# Altium project LA_Probe.PrjPcb
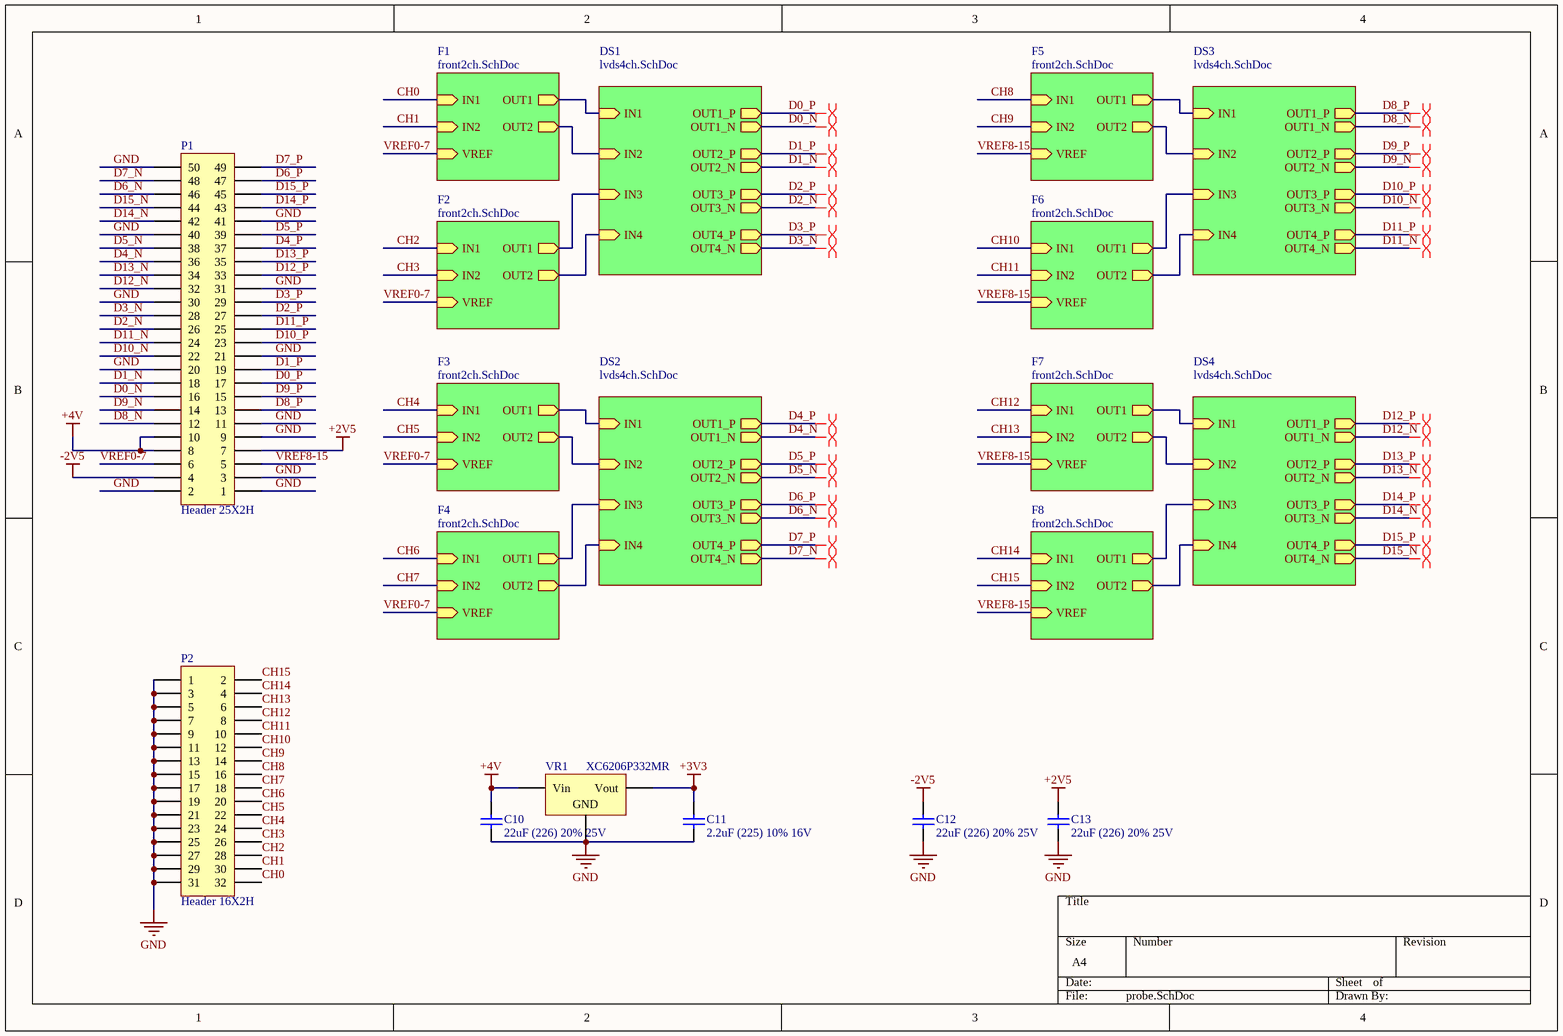
[diagram p0: probe.SchDoc]
3 sheets, 179 parts. Net scope: hierarchical (ports join the sheet entries above them; power ports are global).
Board file: probe.PcbDoc
Sheets:
  probe.SchDoc
    F1 = front2ch.SchDoc
    F2 = front2ch.SchDoc
    DS1 = lvds4ch.SchDoc
    F3 = front2ch.SchDoc
    F4 = front2ch.SchDoc
    DS2 = lvds4ch.SchDoc
    F5 = front2ch.SchDoc
    F6 = front2ch.SchDoc
    DS3 = lvds4ch.SchDoc
    F7 = front2ch.SchDoc
    F8 = front2ch.SchDoc
    DS4 = lvds4ch.SchDoc

## Sheet probe.SchDoc
size A4

### Parts
C10  22uF (226) 20% 25V  [0805_C]
C11  2.2uF (225) 10% 16V  [0603_C]
C12  22uF (226) 20% 25V  [0805_C]
C13  22uF (226) 20% 25V  [0805_C]
P1  Header 25X2H  [HDR2X25H]
P2  Header 16X2H  [HDR2X16H]
VR1  XC6206P332MR  [SOT-23-3L]

### Sub-sheets
DS1 = lvds4ch.SchDoc: OUT4_N (out), OUT3_P (out), OUT2_P (out), OUT1_P (out), OUT4_P (out), OUT2_N (out), OUT3_N (out), IN4 (in), IN3 (in), OUT1_N (out), IN1 (in), IN2 (in)
DS2 = lvds4ch.SchDoc: OUT4_N (out), OUT3_P (out), OUT2_P (out), OUT1_P (out), OUT4_P (out), OUT2_N (out), OUT3_N (out), IN4 (in), IN3 (in), OUT1_N (out), IN1 (in), IN2 (in)
DS3 = lvds4ch.SchDoc: OUT4_N (out), OUT3_P (out), OUT2_P (out), OUT1_P (out), OUT4_P (out), OUT2_N (out), OUT3_N (out), IN4 (in), IN3 (in), OUT1_N (out), IN1 (in), IN2 (in)
DS4 = lvds4ch.SchDoc: OUT4_N (out), OUT3_P (out), OUT2_P (out), OUT1_P (out), OUT4_P (out), OUT2_N (out), OUT3_N (out), IN4 (in), IN3 (in), OUT1_N (out), IN1 (in), IN2 (in)
F1 = front2ch.SchDoc: IN1 (in), OUT1 (out), IN2 (in), VREF (in), OUT2 (out)
F2 = front2ch.SchDoc: IN1 (in), OUT1 (out), IN2 (in), VREF (in), OUT2 (out)
F3 = front2ch.SchDoc: IN1 (in), OUT1 (out), IN2 (in), VREF (in), OUT2 (out)
F4 = front2ch.SchDoc: IN1 (in), OUT1 (out), IN2 (in), VREF (in), OUT2 (out)
F5 = front2ch.SchDoc: IN1 (in), OUT1 (out), IN2 (in), VREF (in), OUT2 (out)
F6 = front2ch.SchDoc: IN1 (in), OUT1 (out), IN2 (in), VREF (in), OUT2 (out)
F7 = front2ch.SchDoc: IN1 (in), OUT1 (out), IN2 (in), VREF (in), OUT2 (out)
F8 = front2ch.SchDoc: IN1 (in), OUT1 (out), IN2 (in), VREF (in), OUT2 (out)

### Nets
+2V5: C13.2 P1.7
+3V3: C11.2 VR1.2(Vout)
+4V: C10.2 P1.8 P1.10 VR1.3(Vin)
-2V5: C12.2 P1.4
GND: C10.1 C11.1 C12.1 C13.1 P1.1 P1.2 P1.3 P1.9 P1.11 P1.20 P1.21 P1.30 P1.31 P1.40 P1.41 P1.50 P2.1 P2.3 P2.5 P2.7 P2.9 P2.11 P2.13 P2.15 P2.17 P2.19 P2.21 P2.23 P2.25 P2.27 P2.29 P2.31 VR1.1(GND)
CH0: P2.32 ; sheet F1/IN1
CH1: P2.30 ; sheet F1/IN2
CH2: P2.28 ; sheet F2/IN1
CH3: P2.26 ; sheet F2/IN2
CH4: P2.24 ; sheet F3/IN1
CH5: P2.22 ; sheet F3/IN2
CH6: P2.20 ; sheet F4/IN1
CH7: P2.18 ; sheet F4/IN2
CH8: P2.16 ; sheet F5/IN1
CH9: P2.14 ; sheet F5/IN2
CH10: P2.12 ; sheet F6/IN1
CH11: P2.10 ; sheet F6/IN2
CH12: P2.8 ; sheet F7/IN1
CH13: P2.6 ; sheet F7/IN2
CH14: P2.4 ; sheet F8/IN1
CH15: P2.2 ; sheet F8/IN2
D0_N: P1.16 ; sheet DS1/OUT1_N
D0_P: P1.17 ; sheet DS1/OUT1_P
D1_N: P1.18 ; sheet DS1/OUT2_N
D1_P: P1.19 ; sheet DS1/OUT2_P
D2_N: P1.26 ; sheet DS1/OUT3_N
D2_P: P1.27 ; sheet DS1/OUT3_P
D3_N: P1.28 ; sheet DS1/OUT4_N
D3_P: P1.29 ; sheet DS1/OUT4_P
D4_N: P1.36 ; sheet DS2/OUT1_N
D4_P: P1.37 ; sheet DS2/OUT1_P
D5_N: P1.38 ; sheet DS2/OUT2_N
D5_P: P1.39 ; sheet DS2/OUT2_P
D6_N: P1.46 ; sheet DS2/OUT3_N
D6_P: P1.47 ; sheet DS2/OUT3_P
D7_N: P1.48 ; sheet DS2/OUT4_N
D7_P: P1.49 ; sheet DS2/OUT4_P
D8_N: P1.12 ; sheet DS3/OUT1_N
D8_P: P1.13 ; sheet DS3/OUT1_P
D9_N: P1.14 ; sheet DS3/OUT2_N
D9_P: P1.15 ; sheet DS3/OUT2_P
D10_N: P1.22 ; sheet DS3/OUT3_N
D10_P: P1.23 ; sheet DS3/OUT3_P
D11_N: P1.24 ; sheet DS3/OUT4_N
D11_P: P1.25 ; sheet DS3/OUT4_P
D12_N: P1.32 ; sheet DS4/OUT1_N
D12_P: P1.33 ; sheet DS4/OUT1_P
D13_N: P1.34 ; sheet DS4/OUT2_N
D13_P: P1.35 ; sheet DS4/OUT2_P
D14_N: P1.42 ; sheet DS4/OUT3_N
D14_P: P1.43 ; sheet DS4/OUT3_P
D15_N: P1.44 ; sheet DS4/OUT4_N
D15_P: P1.45 ; sheet DS4/OUT4_P
VREF0-7: P1.6 ; sheet F1/VREF, sheet F2/VREF, sheet F3/VREF, sheet F4/VREF
VREF8-15: P1.5 ; sheet F5/VREF, sheet F6/VREF, sheet F7/VREF, sheet F8/VREF
NetD1_F1_2: sheet F1/OUT1, sheet DS1/IN1
NetD1_F2_2: sheet F2/OUT1, sheet DS1/IN3
NetD1_F3_2: sheet F3/OUT1, sheet DS2/IN1
NetD1_F4_2: sheet F4/OUT1, sheet DS2/IN3
NetD1_F5_2: sheet F5/OUT1, sheet DS3/IN1
NetD1_F6_2: sheet F6/OUT1, sheet DS3/IN3
NetD1_F7_2: sheet F7/OUT1, sheet DS4/IN1
NetD1_F8_2: sheet F8/OUT1, sheet DS4/IN3
NetD2_F1_2: sheet F1/OUT2, sheet DS1/IN2
NetD2_F2_2: sheet F2/OUT2, sheet DS1/IN4
NetD2_F3_2: sheet F3/OUT2, sheet DS2/IN2
NetD2_F4_2: sheet F4/OUT2, sheet DS2/IN4
NetD2_F5_2: sheet F5/OUT2, sheet DS3/IN2
NetD2_F6_2: sheet F6/OUT2, sheet DS3/IN4
NetD2_F7_2: sheet F7/OUT2, sheet DS4/IN2
NetD2_F8_2: sheet F8/OUT2, sheet DS4/IN4

### Layout directives
differential pair: D0_N, D0_P, D1_N, D1_P, D2_N, D2_P, D3_N, D3_P, D4_N, D4_P, D5_N, D5_P, D6_N, D6_P, D7_N, D7_P, D8_N, D8_P, D9_N, D9_P, D10_N, D10_P, D11_N, D11_P, D12_N, D12_P, D13_N, D13_P, D14_N, D14_P, D15_N, D15_P

### Library data of the parts
C10 C12 C13 = 0805 22uF (226) 20% 25V: 贴片电容; ComponentLink1Description: 供应商链接; ComponentLink1URL: http://www.szlcsc.com/product/details_46786.html; Package: 0805; Supplier: LC; SuppliersPartNumber: C45783
C11 = 0603 2.2uF (225) 10% 16V: 贴片电容; ComponentLink1Description: 供应商链接; ComponentLink1URL: http://www.szlcsc.com/product/details_24366.html; Package: 0603; Supplier: LC; SuppliersPartNumber: C23630
P1 = Header 25X2H: Header, 25-Pin, Dual row, Right Angle; LatestRevisionDate: 17-Jul-2002; LatestRevisionNote: Re-released for DXP Platform.; Publisher: Altium Limited
P2 = Header 16X2H: Header, 16-Pin, Dual row, Right Angle; LatestRevisionDate: 17-Jul-2002; LatestRevisionNote: Re-released for DXP Platform.; Publisher: Altium Limited
VR1 = SOT-23 XC6206P332MR: 低压差线性稳压(LDO); ComponentLink1Description: 供应商链接; ComponentLink1URL: http://www.szlcsc.com/product/details_5896.html; Package: SOT-23; Supplier: LC; SuppliersPartNumber: C5446

## Sheet front2ch.SchDoc
size A4
Used 8 times, as channels F1, F2, F3, F4, F5, F6, F7, F8. Parts and nets are listed once, with the designators drawn on the sheet.
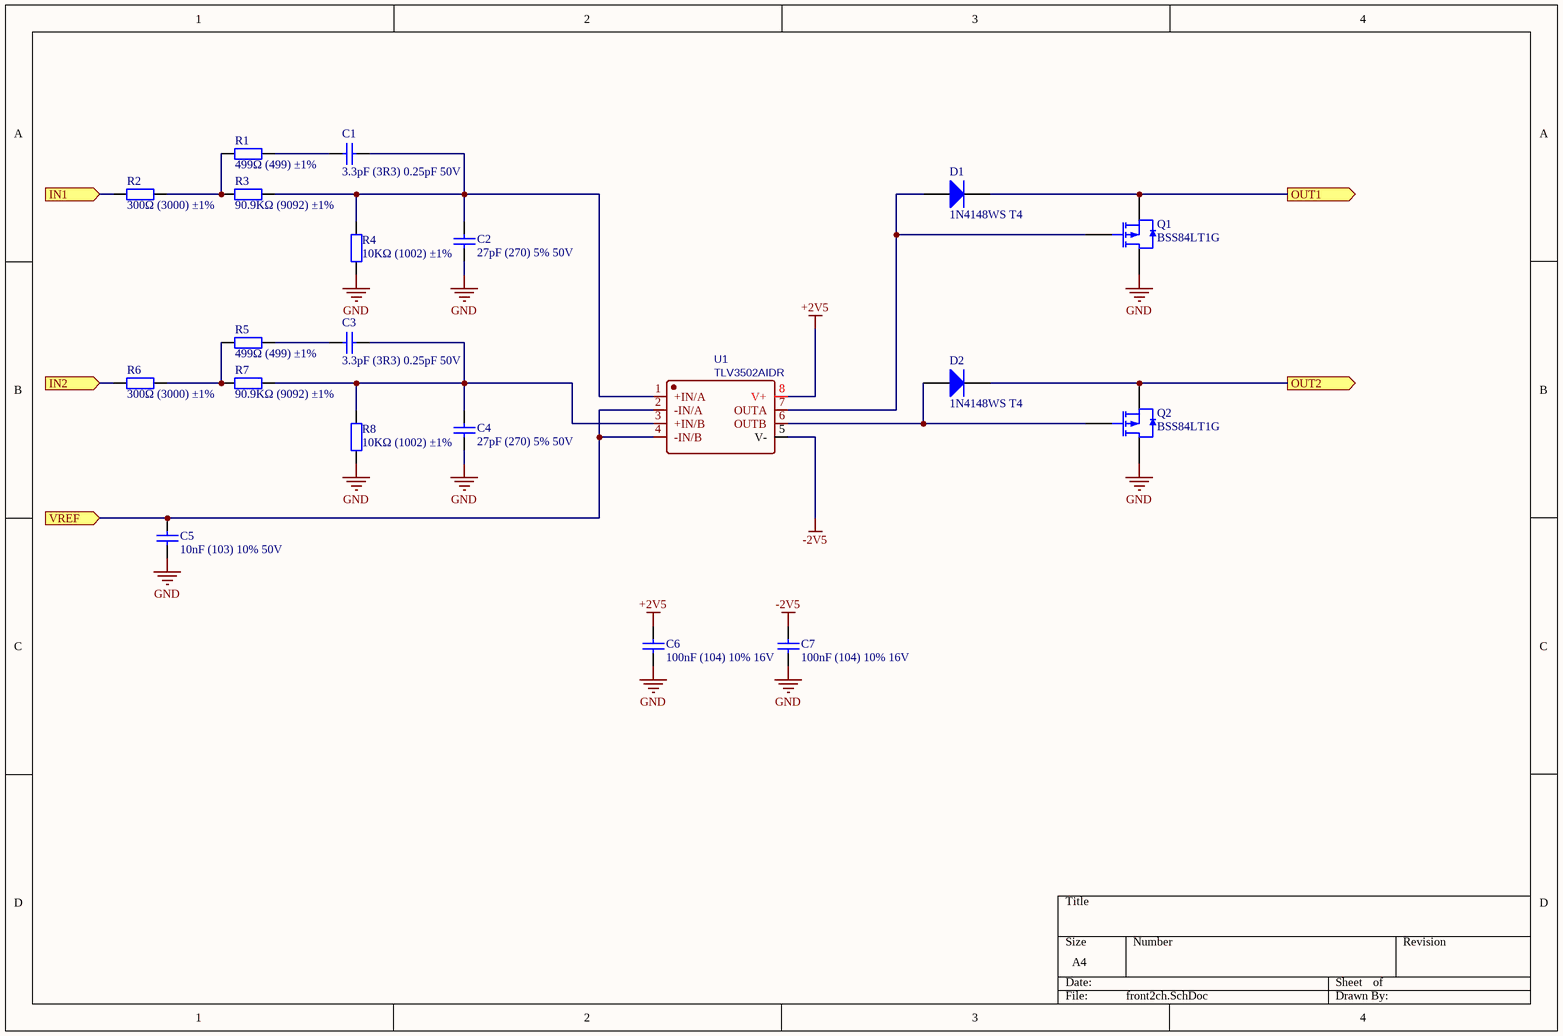
[diagram p1: front2ch.SchDoc]

### Parts
C1  3.3pF (3R3) 0.25pF 50V  [0402_C]
C2  27pF (270) 5% 50V  [0402_C]
C3  3.3pF (3R3) 0.25pF 50V  [0402_C]
C4  27pF (270) 5% 50V  [0402_C]
C5  10nF (103) 10% 50V  [0402_C]
C6  100nF (104) 10% 16V  [0402_C]
C7  100nF (104) 10% 16V  [0402_C]
D1  1N4148WS T4  [SOD-323]
D2  1N4148WS T4  [SOD-323]
Q1  BSS84LT1G  [SOT-23(SOT-23-3)]
Q2  BSS84LT1G  [SOT-23(SOT-23-3)]
R1  499Ω (499) ±1%  [0402_R]
R2  300Ω (3000) ±1%  [0402_R]
R3  90.9KΩ (9092) ±1%  [0402_R]
R4  10KΩ (1002) ±1%  [0402_R]
R5  499Ω (499) ±1%  [0402_R]
R6  300Ω (3000) ±1%  [0402_R]
R7  90.9KΩ (9092) ±1%  [0402_R]
R8  10KΩ (1002) ±1%  [0402_R]
U1  TLV3502AIDR  [SOIC-8_150mil]

### Ports
IN1 (in), IN2 (in), OUT1 (out), OUT2 (out), VREF (in)

### Nets
+2V5: C6.2 U1.8(V+)
-2V5: C7.2 U1.5(V-)
GND: C2.1 C4.1 C5.1 C6.1 C7.1 Q1.3(D) Q2.3(D) R4.1 R8.1
IN1: R2.1 ; port IN1
IN2: R6.1 ; port IN2
OUT1: D1.2(K) Q1.2(S) ; port OUT1
OUT2: D2.2(K) Q2.2(S) ; port OUT2
VREF: C5.2 U1.2(-IN/A) U1.4(-IN/B) ; port VREF
NetC1_1: C1.1 R1.2
NetC1_2: C1.2 C2.2 R3.2 R4.2 U1.1(+IN/A)
NetC3_1: C3.1 R5.2
NetC3_2: C3.2 C4.2 R7.2 R8.2 U1.3(+IN/B)
NetD1_1: D1.1(A) Q1.1(G) U1.7(OUTA)
NetD2_1: D2.1(A) Q2.1(G) U1.6(OUTB)
NetR1_1: R1.1 R2.2 R3.1
NetR5_1: R5.1 R6.2 R7.1

### Channels
F1: designators end in _F1; ports IN1=CH0 IN2=CH1 OUT1=NetD1_F1_2 OUT2=NetD2_F1_2 VREF=VREF0-7
F2: designators end in _F2; ports IN1=CH2 IN2=CH3 OUT1=NetD1_F2_2 OUT2=NetD2_F2_2 VREF=VREF0-7
F3: designators end in _F3; ports IN1=CH4 IN2=CH5 OUT1=NetD1_F3_2 OUT2=NetD2_F3_2 VREF=VREF0-7
F4: designators end in _F4; ports IN1=CH6 IN2=CH7 OUT1=NetD1_F4_2 OUT2=NetD2_F4_2 VREF=VREF0-7
F5: designators end in _F5; ports IN1=CH8 IN2=CH9 OUT1=NetD1_F5_2 OUT2=NetD2_F5_2 VREF=VREF8-15
F6: designators end in _F6; ports IN1=CH10 IN2=CH11 OUT1=NetD1_F6_2 OUT2=NetD2_F6_2 VREF=VREF8-15
F7: designators end in _F7; ports IN1=CH12 IN2=CH13 OUT1=NetD1_F7_2 OUT2=NetD2_F7_2 VREF=VREF8-15
F8: designators end in _F8; ports IN1=CH14 IN2=CH15 OUT1=NetD1_F8_2 OUT2=NetD2_F8_2 VREF=VREF8-15

### Library data of the parts
C1 C3 = 0402 3.3pF (3R3) 0.25pF 50V: 贴片电容; ComponentLink1Description: 供应商链接; ComponentLink1URL: http://www.szlcsc.com/product/details_1917.html; Package: 0402; Supplier: LC; SuppliersPartNumber: C1565
C2 C4 = 0402 27pF (270) 5% 50V: 贴片电容; ComponentLink1Description: 供应商链接; ComponentLink1URL: http://www.szlcsc.com/product/details_1909.html; Package: 0402; Supplier: LC; SuppliersPartNumber: C1557
C5 = 0402 10nF (103) 10% 50V: 贴片电容; ComponentLink1Description: 供应商链接; ComponentLink1URL: http://www.szlcsc.com/product/details_15869.html; Package: 0402; Supplier: LC; SuppliersPartNumber: C15195
C6 C7 = 0402 100nF (104) 10% 16V: 贴片电容; ComponentLink1Description: 供应商链接; ComponentLink1URL: http://www.szlcsc.com/product/details_1877.html; Package: 0402; Supplier: LC; SuppliersPartNumber: C1525
D1 D2 = SOD-323 1N4148WS T4: 二极管; ComponentLink1Description: 供应商链接; ComponentLink1URL: http://www.szlcsc.com/product/details_2485.html; Package: SOD-323; Supplier: LC; SuppliersPartNumber: C2128
Q1 Q2 = BSS84LT1G: MOS(场效应管); ComponentLink1Description: 供应商链接; ComponentLink1URL: http://www.szlcsc.com/product/details_8986.html; Package: SOT-23(SOT-23-3); Supplier: LC; SuppliersPartNumber: C8492
R1 R5 = 0402 49.9Ω (49R9) 1%: 贴片电阻; ComponentLink1Description: 供应商链接; ComponentLink1URL: http://www.szlcsc.com/product/details_25863.html; Package: 0402; Supplier: LC; SuppliersPartNumber: C57982
R2 R6 = 0402 300Ω (3000) 1%: 贴片电阻; ComponentLink1Description: 供应商链接; ComponentLink1URL: http://www.szlcsc.com/product/details_25845.html; Package: 0402; Supplier: LC; SuppliersPartNumber: C25102
R3 R7 = 0402 8.2KΩ (8201) 1%: 贴片电阻; ComponentLink1Description: 供应商链接; ComponentLink1URL: http://www.szlcsc.com/product/details_26667.html; Package: 0402; Supplier: LC; SuppliersPartNumber: C26989
R4 R8 = 0402 10KΩ (1002) 1%: 贴片电阻; ComponentLink1Description: 供应商链接; ComponentLink1URL: http://www.szlcsc.com/product/details_26487.html; Package: 0402; Supplier: LC; SuppliersPartNumber: C25744
U1 = TLV3502AIDR: BOM_Manufacturer: TI; Contributor: LCSC; SMT Type: Extend; BOM_Supplier: LCSC; BOM_Manufacturer Part: TLV3502AIDR; BOM_Supplier Part: C131165; BOM_LCSC Assembly: Yes; spicePre: U; spiceSymbolName: TLV3502AIDR

## Sheet lvds4ch.SchDoc
size A4
Used 4 times, as channels DS1, DS2, DS3, DS4. Parts and nets are listed once, with the designators drawn on the sheet.
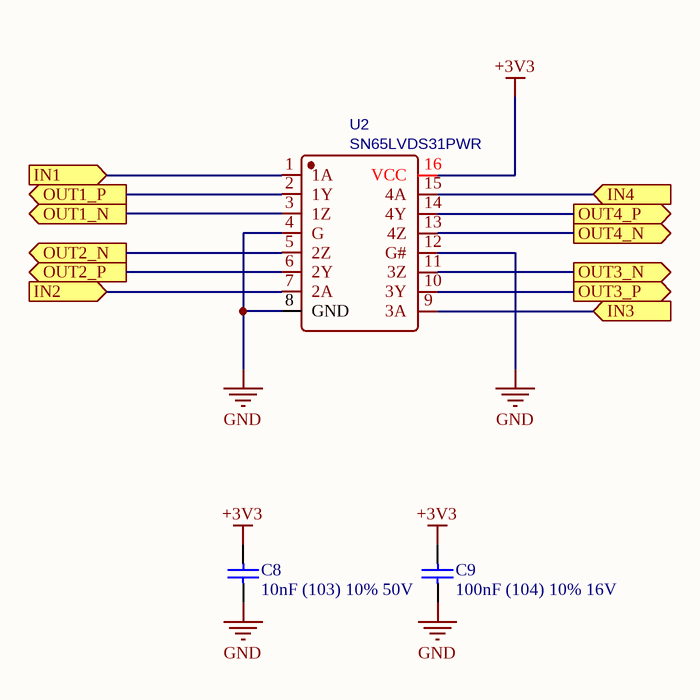
[diagram p2: lvds4ch.SchDoc]

### Parts
C8  10nF (103) 10% 50V  [0402_C]
C9  100nF (104) 10% 16V  [0402_C]
U2  SN65LVDS31PWR  [TSSOP-16_L5.0-W4.4-P0.65-LS6.4-BL]

### Ports
IN1 (in), IN2 (in), IN3 (in), IN4 (in), OUT1_N (out), OUT1_P (out), OUT2_N (out), OUT2_P (out), OUT3_N (out), OUT3_P (out), OUT4_N (out), OUT4_P (out)

### Nets
+3V3: C8.2 C9.2 U2.16(VCC)
GND: C8.1 C9.1 U2.4(G) U2.8(GND) U2.12(G#)
IN1: U2.1(1A) ; port IN1
IN2: U2.7(2A) ; port IN2
IN3: U2.9(3A) ; port IN3
IN4: U2.15(4A) ; port IN4
OUT1_N: U2.3(1Z) ; port OUT1_N
OUT1_P: U2.2(1Y) ; port OUT1_P
OUT2_N: U2.5(2Z) ; port OUT2_N
OUT2_P: U2.6(2Y) ; port OUT2_P
OUT3_N: U2.11(3Z) ; port OUT3_N
OUT3_P: U2.10(3Y) ; port OUT3_P
OUT4_N: U2.13(4Z) ; port OUT4_N
OUT4_P: U2.14(4Y) ; port OUT4_P

### Channels
DS1: designators end in _DS1; ports IN1=NetD1_F1_2 IN2=NetD2_F1_2 IN3=NetD1_F2_2 IN4=NetD2_F2_2 OUT1_N=D0_N OUT1_P=D0_P OUT2_N=D1_N OUT2_P=D1_P OUT3_N=D2_N OUT3_P=D2_P OUT4_N=D3_N OUT4_P=D3_P
DS2: designators end in _DS2; ports IN1=NetD1_F3_2 IN2=NetD2_F3_2 IN3=NetD1_F4_2 IN4=NetD2_F4_2 OUT1_N=D4_N OUT1_P=D4_P OUT2_N=D5_N OUT2_P=D5_P OUT3_N=D6_N OUT3_P=D6_P OUT4_N=D7_N OUT4_P=D7_P
DS3: designators end in _DS3; ports IN1=NetD1_F5_2 IN2=NetD2_F5_2 IN3=NetD1_F6_2 IN4=NetD2_F6_2 OUT1_N=D8_N OUT1_P=D8_P OUT2_N=D9_N OUT2_P=D9_P OUT3_N=D10_N OUT3_P=D10_P OUT4_N=D11_N OUT4_P=D11_P
DS4: designators end in _DS4; ports IN1=NetD1_F7_2 IN2=NetD2_F7_2 IN3=NetD1_F8_2 IN4=NetD2_F8_2 OUT1_N=D12_N OUT1_P=D12_P OUT2_N=D13_N OUT2_P=D13_P OUT3_N=D14_N OUT3_P=D14_P OUT4_N=D15_N OUT4_P=D15_P

### Library data of the parts
C8 = 0402 10nF (103) 10% 50V: 贴片电容; ComponentLink1Description: 供应商链接; ComponentLink1URL: http://www.szlcsc.com/product/details_15869.html; Package: 0402; Supplier: LC; SuppliersPartNumber: C15195
C9 = 0402 100nF (104) 10% 16V: 贴片电容; ComponentLink1Description: 供应商链接; ComponentLink1URL: http://www.szlcsc.com/product/details_1877.html; Package: 0402; Supplier: LC; SuppliersPartNumber: C1525
U2 = SN65LVDS31PWR: BOM_Manufacturer: TI; Voltage - Supply: 3V ~ 3.6V; Contributor: LCSC; SMT Type: Extend; BOM_Supplier: LCSC; BOM_Manufacturer Part: SN65LVDS31PWR; Type: Driver; BOM_Supplier Part: C181630; BOM_LCSC Assembly: Yes; spicePre: U; spiceSymbolName: SN65LVDS31PWR

## Nets that join several sheets
+2V5: probe (C13.2 P1.7), F1 (C6_F1.2 U1_F1.8), F2 (C6_F2.2 U1_F2.8), F3 (C6_F3.2 U1_F3.8), F4 (C6_F4.2 U1_F4.8), F5 (C6_F5.2 U1_F5.8), F6 (C6_F6.2 U1_F6.8), F7 (C6_F7.2 U1_F7.8), F8 (C6_F8.2 U1_F8.8)
+3V3: probe (C11.2 VR1.2), DS1 (C8_DS1.2 C9_DS1.2 U2_DS1.16), DS2 (C8_DS2.2 C9_DS2.2 U2_DS2.16), DS3 (C8_DS3.2 C9_DS3.2 U2_DS3.16), DS4 (C8_DS4.2 C9_DS4.2 U2_DS4.16)
-2V5: probe (C12.2 P1.4), F1 (C7_F1.2 U1_F1.5), F2 (C7_F2.2 U1_F2.5), F3 (C7_F3.2 U1_F3.5), F4 (C7_F4.2 U1_F4.5), F5 (C7_F5.2 U1_F5.5), F6 (C7_F6.2 U1_F6.5), F7 (C7_F7.2 U1_F7.5), F8 (C7_F8.2 U1_F8.5)
GND: probe (33 pins), F1 (9 pins), F2 (9 pins), DS1 (5 pins), F3 (9 pins), F4 (9 pins), DS2 (5 pins), F5 (9 pins), F6 (9 pins), DS3 (5 pins), F7 (9 pins), F8 (9 pins), DS4 (5 pins)
CH0: probe (P2.32), F1 (R2_F1.1)
CH1: probe (P2.30), F1 (R6_F1.1)
CH2: probe (P2.28), F2 (R2_F2.1)
CH3: probe (P2.26), F2 (R6_F2.1)
CH4: probe (P2.24), F3 (R2_F3.1)
CH5: probe (P2.22), F3 (R6_F3.1)
CH6: probe (P2.20), F4 (R2_F4.1)
CH7: probe (P2.18), F4 (R6_F4.1)
CH8: probe (P2.16), F5 (R2_F5.1)
CH9: probe (P2.14), F5 (R6_F5.1)
CH10: probe (P2.12), F6 (R2_F6.1)
CH11: probe (P2.10), F6 (R6_F6.1)
CH12: probe (P2.8), F7 (R2_F7.1)
CH13: probe (P2.6), F7 (R6_F7.1)
CH14: probe (P2.4), F8 (R2_F8.1)
CH15: probe (P2.2), F8 (R6_F8.1)
D0_N: probe (P1.16), DS1 (U2_DS1.3)
D0_P: probe (P1.17), DS1 (U2_DS1.2)
D1_N: probe (P1.18), DS1 (U2_DS1.5)
D1_P: probe (P1.19), DS1 (U2_DS1.6)
D2_N: probe (P1.26), DS1 (U2_DS1.11)
D2_P: probe (P1.27), DS1 (U2_DS1.10)
D3_N: probe (P1.28), DS1 (U2_DS1.13)
D3_P: probe (P1.29), DS1 (U2_DS1.14)
D4_N: probe (P1.36), DS2 (U2_DS2.3)
D4_P: probe (P1.37), DS2 (U2_DS2.2)
D5_N: probe (P1.38), DS2 (U2_DS2.5)
D5_P: probe (P1.39), DS2 (U2_DS2.6)
D6_N: probe (P1.46), DS2 (U2_DS2.11)
D6_P: probe (P1.47), DS2 (U2_DS2.10)
D7_N: probe (P1.48), DS2 (U2_DS2.13)
D7_P: probe (P1.49), DS2 (U2_DS2.14)
D8_N: probe (P1.12), DS3 (U2_DS3.3)
D8_P: probe (P1.13), DS3 (U2_DS3.2)
D9_N: probe (P1.14), DS3 (U2_DS3.5)
D9_P: probe (P1.15), DS3 (U2_DS3.6)
D10_N: probe (P1.22), DS3 (U2_DS3.11)
D10_P: probe (P1.23), DS3 (U2_DS3.10)
D11_N: probe (P1.24), DS3 (U2_DS3.13)
D11_P: probe (P1.25), DS3 (U2_DS3.14)
D12_N: probe (P1.32), DS4 (U2_DS4.3)
D12_P: probe (P1.33), DS4 (U2_DS4.2)
D13_N: probe (P1.34), DS4 (U2_DS4.5)
D13_P: probe (P1.35), DS4 (U2_DS4.6)
D14_N: probe (P1.42), DS4 (U2_DS4.11)
D14_P: probe (P1.43), DS4 (U2_DS4.10)
D15_N: probe (P1.44), DS4 (U2_DS4.13)
D15_P: probe (P1.45), DS4 (U2_DS4.14)
NetD1_F1_2: F1 (D1_F1.2 Q1_F1.2), DS1 (U2_DS1.1)
NetD1_F2_2: F2 (D1_F2.2 Q1_F2.2), DS1 (U2_DS1.9)
NetD1_F3_2: F3 (D1_F3.2 Q1_F3.2), DS2 (U2_DS2.1)
NetD1_F4_2: F4 (D1_F4.2 Q1_F4.2), DS2 (U2_DS2.9)
NetD1_F5_2: F5 (D1_F5.2 Q1_F5.2), DS3 (U2_DS3.1)
NetD1_F6_2: F6 (D1_F6.2 Q1_F6.2), DS3 (U2_DS3.9)
NetD1_F7_2: F7 (D1_F7.2 Q1_F7.2), DS4 (U2_DS4.1)
NetD1_F8_2: F8 (D1_F8.2 Q1_F8.2), DS4 (U2_DS4.9)
NetD2_F1_2: F1 (D2_F1.2 Q2_F1.2), DS1 (U2_DS1.7)
NetD2_F2_2: F2 (D2_F2.2 Q2_F2.2), DS1 (U2_DS1.15)
NetD2_F3_2: F3 (D2_F3.2 Q2_F3.2), DS2 (U2_DS2.7)
NetD2_F4_2: F4 (D2_F4.2 Q2_F4.2), DS2 (U2_DS2.15)
NetD2_F5_2: F5 (D2_F5.2 Q2_F5.2), DS3 (U2_DS3.7)
NetD2_F6_2: F6 (D2_F6.2 Q2_F6.2), DS3 (U2_DS3.15)
NetD2_F7_2: F7 (D2_F7.2 Q2_F7.2), DS4 (U2_DS4.7)
NetD2_F8_2: F8 (D2_F8.2 Q2_F8.2), DS4 (U2_DS4.15)
VREF0-7: probe (P1.6), F1 (C5_F1.2 U1_F1.2 U1_F1.4), F2 (C5_F2.2 U1_F2.2 U1_F2.4), F3 (C5_F3.2 U1_F3.2 U1_F3.4), F4 (C5_F4.2 U1_F4.2 U1_F4.4)
VREF8-15: probe (P1.5), F5 (C5_F5.2 U1_F5.2 U1_F5.4), F6 (C5_F6.2 U1_F6.2 U1_F6.4), F7 (C5_F7.2 U1_F7.2 U1_F7.4), F8 (C5_F8.2 U1_F8.2 U1_F8.4)